# Altium project Avionics GLoBe - NEO9N.PrjPcb
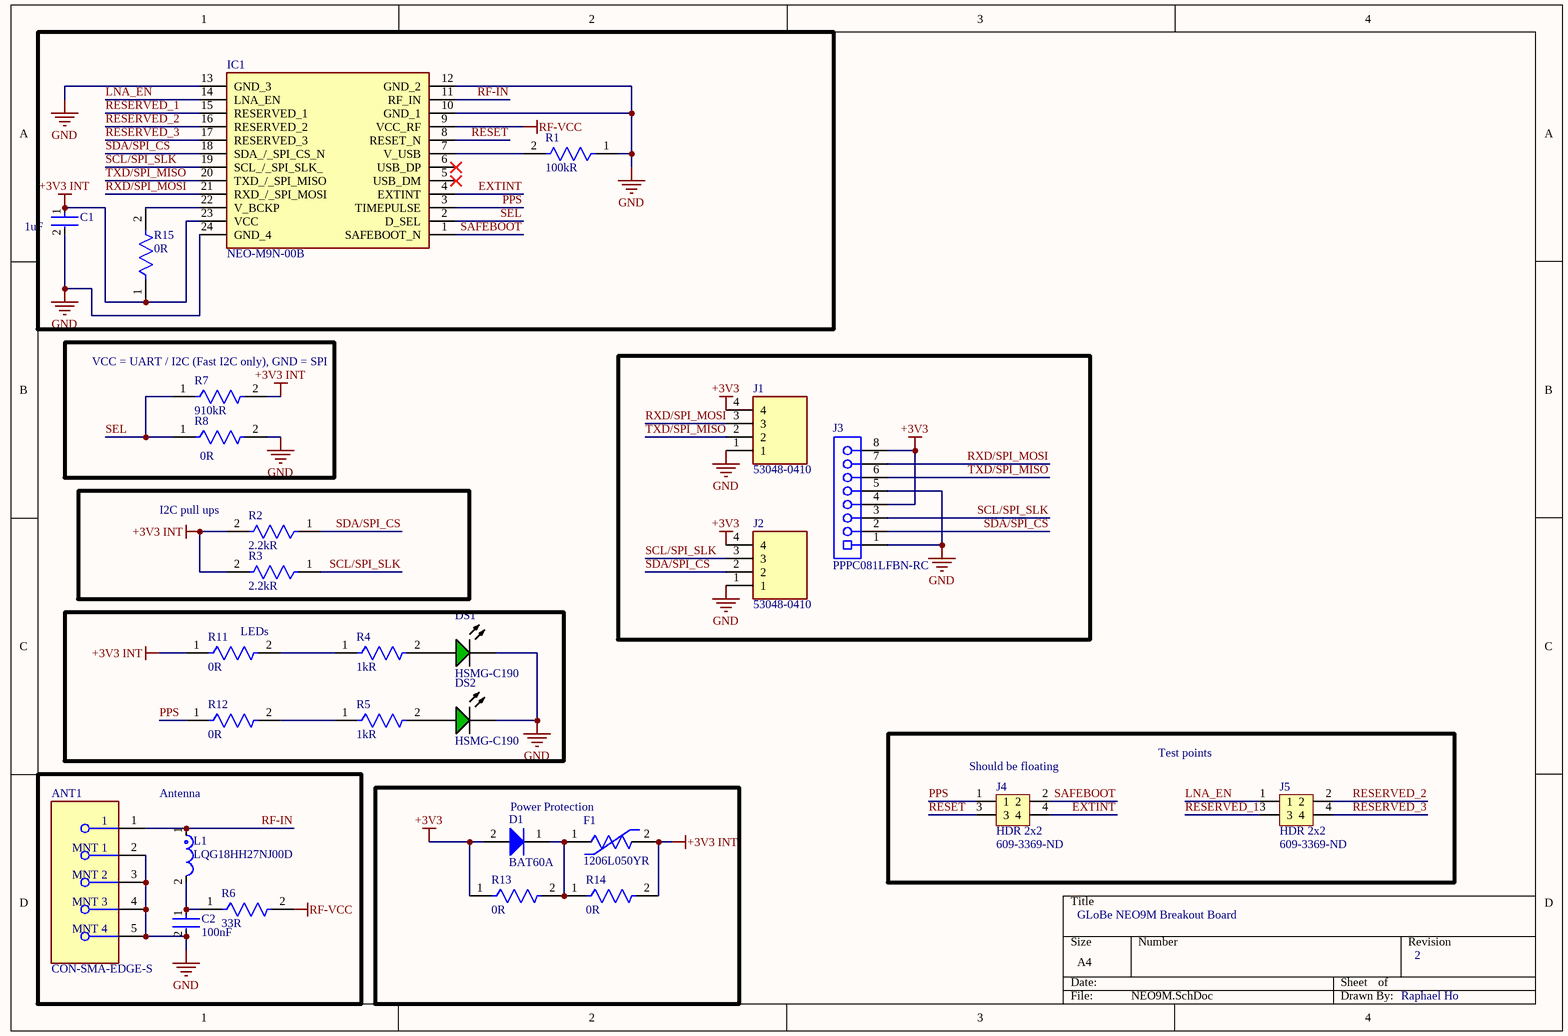
[diagram p0: NEO9M.SchDoc]
1 sheet, 27 parts. Net scope: global (net labels, ports and power ports of the same name join across sheets).
Board file: NEO9M.PcbDoc

## Sheet NEO9M.SchDoc
size A4; SheetNumber: 1; SheetTotal: 1

### Parts
ANT1  CON-SMA-EDGE-S  [FP-CON-SMA-EDGE-S-MFG]
C1  1uF  [FP-GCM188-0_1-IPC_B]
C2  100nF  [FP-GCM188-0_1-IPC_A]
D1  BAT60A  [INF-SOD323_V]
DS1  HSMG-C190  [AVAG-HSMX-C190_V]
DS2  HSMG-C190  [AVAG-HSMX-C190_V]
F1  1206L050YR  [FP-1206L050YR-MFG]
IC1  NEO-M9N-00B  [NEOM9N00B]
J1  53048-0410  [530480410]
J2  53048-0410  [530480410]
J3  PPPC081LFBN-RC  [SLIN-PPPC081LFBN-RC_V]
J4  HDR 2x2  Supplier Part Number 1: 609-3369-ND  [HDR_2x2_2.54mm]
J5  HDR 2x2  Supplier Part Number 1: 609-3369-ND  [HDR_2x2_2.54mm]
L1  LQG18HH27NJ00D  [FP-LQG18HH_00-IPC_C]
R1  100kR  [FP-AC0603-MFG]
R2  2.2kR  [FP-AC0603-IPC_B]
R3  2.2kR  [FP-AC0603-IPC_B]
R4  1kR  [FP-AC0603-IPC_A]
R5  1kR  [FP-AC0603-IPC_A]
R6  33R  [FP-AC0603-IPC_C]
R7  910kR  [FP-AC0603-IPC_B]
R8  0R  [FP-AC0603-IPC_A]
R11  0R  [FP-AC0603-IPC_A]
R12  0R  [FP-AC0603-IPC_A]
R13  0R  [FP-AC0603-IPC_A]
R14  0R  [FP-AC0603-IPC_A]
R15  0R  [FP-AC0603-IPC_A]

### Blocks framed on the sheet
VCC = UART / I2C (Fast I2C only), GND = SPI: R7 R8
I2C pull ups: R2 R3
LEDs: DS1 DS2 R4 R5 R11 R12
Antenna: ANT1 C2 L1 R6
Power Protection: D1 F1 R13 R14

### Nets
+3V3: D1.2(A) J1.4 J2.4 J3.4 J3.8 R13.1
+3V3 INT: C1.1 F1.2 IC1.23(VCC) R2.2 R3.2 R7.2 R11.1 R14.2 R15.1
GND: ANT1.2(MNT_1) ANT1.3(MNT_2) ANT1.4(MNT_3) ANT1.5(MNT_4) C1.2 C2.2 DS1.2(K) DS2.2(K) IC1.10(GND_1) IC1.12(GND_2) IC1.13(GND_3) IC1.24(GND_4) J1.1 J2.1 J3.1 J3.5 R1.1 R8.2
RF-VCC: IC1.9(VCC_RF) R6.2
EXTINT: IC1.4(EXTINT) J4.4
LNA_EN: IC1.14(LNA_EN) J5.1
PPS: IC1.3(TIMEPULSE) J4.1 R12.1
RESERVED_1: IC1.15(RESERVED_1) J5.3
RESERVED_2: IC1.16(RESERVED_2) J5.2
RESERVED_3: IC1.17(RESERVED_3) J5.4
RESET: IC1.8(RESET_N) J4.3
RF-IN: ANT1.1 IC1.11(RF_IN) L1.1
RXD/SPI_MOSI: IC1.21(RXD_/_SPI_MOSI) J1.3 J3.7
SAFEBOOT: IC1.1(SAFEBOOT_N) J4.2
SCL/SPI_SLK: IC1.19(SCL_/_SPI_SLK_) J2.3 J3.3 R3.1
SDA/SPI_CS: IC1.18(SDA_/_SPI_CS_N) J2.2 J3.2 R2.1
SEL: IC1.2(D_SEL) R7.1 R8.1
TXD/SPI_MISO: IC1.20(TXD_/_SPI_MISO) J1.2 J3.6
NetC2_1: C2.1 L1.2 R6.1
NetD1_1: D1.1(K) F1.1 R13.2 R14.1
NetDS1_1: DS1.1(A) R4.2
NetDS2_1: DS2.1(A) R5.2
NetIC1_7: IC1.7(V_USB) R1.2
NetIC1_22: IC1.22(V_BCKP) R15.2
NetR4_1: R4.1 R11.2
NetR5_1: R5.1 R12.2

Not connected (* = marked no-connect by the designer): IC1 5(USB_DM)* 6(USB_DP)*

### Notes on the sheet
- (near J4) Should be floating
- Test points
- GLoBe NEO9M Breakout Board
- 2
- Raphael Ho

### Library data of the parts
ANT1 = CMP-204357-000001-1: CONN SMA JACK STR EDGE MNT; Manufacturer: RF Solutions Ltd.; Impedance: 50Ω; Conn Orientation: Right Angle; Is Female: yes; Number Of Contacts: 1; Frequency: 18GHz; Shielding: true; Category: Conn; ComponentLink2URL: https://www.rfsolutions.co.uk/downloads/1498648656DS-CON-EDGE-SMA-4.pdf; Octopart: https://octopart.com/con-sma-edge-s-rf+solutions-70967450; Package: CONN_JACK; Manufacturer Part Number: CON-SMA-EDGE-S; Height: 6.35mm; Device Class L1: Connectors; Footprint Url: https://forum.upverter.com/uploads/default/original/3X/b/e/be75b907af57498775929d6d9099689c472e0307.pdf; Contact Material: Gold; ComponentLink2Description: Datasheet; Device Class L2: RF / Coaxial Connectors; RoHS: TRUE; Device Class L3: unset; Digikey Description: CONN SMA JACK STR EDGE MNT; Lead Free: Yes; Automotive: No
C1 = CMP-2006-02357-2: Ceramic Capacitor for Automotive 1uF  ±10% 16VDC X7R 0603 Paper T/R; Voltage: 16V; Thickness: 0.035inch; Width: 0.031inch; Radiation Hardening: No; Depth: 0.8mm; Max Operating Temperature: 125°C; Package Quantity: 1; Ratings: AEC-Q200; Min Operating Temperature: -55°C; Packaging: Tape and Reel; Case Code (Metric): 1608; REACH SVHC: No SVHC; Dielectric: X7R; Case Code (Imperial): 0603; Length: 1.6mm; Height: 0.8mm; Voltage Rating: 16V; Termination: SMD/SMT; Case/Package: 0603; Voltage Rating (DC): 16V; Tolerance: 10%; Capacitance: 1uF; Mount: Surface Mount; Lead Free: Lead Free
C2 = CMP-2006-02376-2: CAP CER 0.1UF 50V X7R 0603; Tolerance: 10%; Depth: 0.8mm; Thickness: 0.035inch; Case/Package: 0603; Max Operating Temperature: 125°C; Termination: SMD/SMT; Dielectric: X7R; Mount: Surface Mount; Ratings: AEC-Q200; Capacitance: 100nF; Packaging: Tape and Reel; Series: GCM; Package Quantity: 1; Voltage Rating (DC): 50V; Case Code (Imperial): 0603; Height: 0.8mm; Voltage Rating: 50V; Case Code (Metric): 1608; Min Operating Temperature: -55°C; Radiation Hardening: No; RoHS Compliant: Yes; Lead Free: Lead Free; Length: 1.6mm; Width: 0.031inch; Construction: Flat
D1 = CMP-1183-00008-2: Silicon Schottky Diode, -55 to 85 degC, SOD323, Reel, Green; Manufacturer: Infineon; Green: TRUE; VR (max): 10Â V; IF (max): 3,000Â mA; VF (max): 370Â mV; CT (max): 35Â pF; Configuration: Single; PackageDescription: 3-Pin Small Outline Transistor Package, 1.25 x 2 mm Body, 0.65 mm Pitch; PartNumber: BAT60A; Mounting Technology: Surface Mount; PackageReference: SOT323; ComponentLink1Description: Manufacturer URL; Packing: Reel; ComponentLink3URL: http://www.infineon.com/dgdl/SOT323-Package_Overview.pdf?folderId=db3a30431936bc4b0119533e1dcb3c92&fileId=db3a30431936bc4b011953495f283cb1; ComponentLink2URL: http://www.infineon.com/dgdl/bat60aseries.pdf?folderId=db3a304313d846880113def5812204a1&fileId=db3a304313d846880113def70c9304a9; ComponentLink1URL: http://www.infineon.com/; ComponentLink2Description: Datasheet; ComponentLink3Description: Package Specification
DS1 DS2 = CMP-1744-00002-1: Chip LED, Green, 2.2 V, -40 to 85 degC, 2-Pin SMD, RoHS, Tape and Reel; Frequency: 400 KHz; Max Supply Voltage: 5.5 V; Access Time: 3500 ns; Clock Frequency: 100 KHz; Case\Package: SOIC; Density: 32 kb; Nominal Supply Current: 2 mA; Interface: Serial; Min Supply Voltage: 1.7 V; Packaging: Tape and Reel; PackageReference: HSMX-C190; ComponentLink2URL: http://docs.avagotech.com/docs/AV02-0551EN; RoHSCompliant: true; Pins: 8; REACH SVHC: No SVHC; Max Operating Temperature: 85 degC; Width: 4 mm; Radiation Hardening: No; Package Quantity: 3000; ComponentLink3Description: Package Specification; ComponentLink1Description: Manufacturer URL; Min Operating Temperature: -40 degC; PackageDescription: 2-Pin Surface Mount Device, Body 1.6 x 0.8 mm, Height 0.9 mm; Max Clock Frequency: 100 KHz; Height: 1.5 mm; ComponentLink1URL: http://www.avagotech.com/; DatasheetVersion: Mar-12; ComponentLink2Description: Datasheet; Mount: Surface Mount; Length: 5 mm; ComponentLink3URL: http://www.fairchildsemi.com/dwg/MA/MA03D.pdf
F1 = CMP-08606-000073-1: PTC RESET FUSE 6V 500MA 1206; Trip Current: 1A; Current Rating: 100A; Resistance: 700mR; Approvals: cULus; Max Power Dissipation: 600mW; Time to Trip: 0.1s; Hold Current: 500mA; Min Operating Temperature: -40°C; Voltage Rating (DC): 6V; Working Voltage: 6V; Package Quantity: 4000; Termination: SMD/SMT; Lead Free: Lead Free; REACH SVHC: No SVHC; Series: 1206L; Max Voltage Rating (DC): 6V; Height: 0.75mm; Terminal Material: Copper; Packaging: Tape and Reel; Case Code (Imperial): 1206; Length: 3.4mm; RoHS Compliant: Yes; Operating Supply Voltage: 6V; Case Code (Metric): 3216; Width: 1.8mm; Max Current Rating: 100A; Case/Package: 1206; Power Dissipation: 600mW; Max Operating Temperature: 85°C; Voltage Rating: 6V
IC1 = NEO-M9N-00B: Integrated Circuit; Manufacturer_Name: U-Blox; Datasheet Link: https://content.u-blox.com/sites/default/files/NEO-M9N-00B_DataSheet_UBX-19014285.pdf; Height: 2.6mm; Manufacturer_Part_Number: NEO-M9N-00B; Mouser Part Number: 377-NEO-M9N-00B; Mouser Price/Stock: https://www.mouser.co.uk/ProductDetail/u-blox/NEO-M9N-00B?qs=DPoM0jnrROVeJ6BHpcwcjw%3D%3D
J1 J2 = 53048-0410: Connector; Manufacturer_Name: Molex; Datasheet Link: https://www.molex.com/pdm_docs/sd/530480410_sd.pdf; Height: 3.7mm; Manufacturer_Part_Number: 53048-0410; Mouser Part Number: 538-53048-0410; Mouser Price/Stock: https://www.mouser.co.uk/ProductDetail/Molex/53048-0410?qs=359VwiUTsp2msj5Tobchuw%3D%3D
J3 = CMP-002-00028-2: Female Header, Pitch 2.54 mm, 1 x 8 Position, Height 8.5 mm, Tail Length 3.2 mm, -40 to 105 degC, RoHS, Bulk; Manufacturer: Sullins; Package Reference: PPPC081LFBN-RC; Connector Type: Header; Datasheet Version: Jan-15; Package Description: Female Header, Pitch 2.54 mm, 1 x 8 Position, Height 8.5 mm, Tail Length 3.2 mm; RoHS Compliant: Unknown; Max Operating Temperature: 105°C; Case/Package: PPPC081LFBN-RC; Min Operating Temperature: -40°C; Datasheet URL: http://sullinscorp.com/catalogs/101_PAGE114-115_.100_FEMALE_HDR.pdf; Gender: Female; Mounting Technology: TH
J4 J5 = 68602-204HLF: CONN HEADER VERT 4POS 2.54MM; Manufacturer: Amphenol FCI; Gender: Male; Connector Type: Male Pin; Number of Positions: 4; Insulation Resistance: 5GR; Current Rating: 3A; Voltage Rating: 1.5kV; Row Spacing: 0.1inch; Contact Post Length: 3.81mm; Manufacturer Part Number: 68602-204HLF; RoHS: Yes; Category: Headers and Wire Housings; Stock 1: 3699; Pricing 1: 1=0,34000, 10=0,31900, 100=0,22320, 500=0,19132, 1000=0,15943, 5000=0,13665, 10000=0,12754 (USD); Mount: Through Hole; Housing Material: Thermoplastic; Contact Plating: Gold,GXT; Color: Black; Contact Material: Bronze; Min Operating Temperature: -65°C; Max Operating Temperature: 125°C; Termination: Solder; Packaging: Bulk; Number of Rows: 2; Number of Contacts: 4; Package Quantity: 100; Contact Gender: Male; Pitch: 2.54mm; Contact Mating Length: 0.23inch; Radiation Hardening: No; Flammability Rating: UL94 V-0; ComponentLink1URL: https://datasheet.ciiva.com/728/67996-728884.pdf?src-supplier=Digi-Key; ComponentLink1Description: https://datasheet.ciiva.com/728/67996-728884.pdf?src-supplier=Digi-Key; Supplier 1: Digi-Key
L1 = CMP-06042-012021-1: Multilayer type Inductor for Automotive 27nH ±5% 0.54Ω 500mA 0603; DC Resistance (DCR): 4.18mR; Packaging: Tape and Reel; Case/Package: 0603; Package Quantity: 4000; Inductance: 27nH; Termination: SMD/SMT
R1 = CMP-2000-04857-2: RES 100kΩ 5.00% 0.1W 0603; Tolerance: 5%; Voltage Rating: 50V; Power Rating: 100mW; Temperature Coefficient: 100ppm/°C; Case Code (Metric): 1608; Min Operating Temperature: -55°C; Number of Terminations: 2; Case Code (Imperial): 0603; Resistor Type: Thick Film; Construction: Rectangular; Features: Moisture Resistant; Case/Package: 0603; Packaging: Tape and Reel; Depth: 0.8mm; RoHS Compliant: Yes; Ratings: AEC-Q200; Lead Free: Lead Free; Max Operating Temperature: 155°C; Resistance: 100kR; Termination: SMD/SMT; Series: AC; Military Standard: Not; Max Power Dissipation: 100mW; Length: 1.6mm
R2 R3 = CMP-2000-04866-2: RES 2.2kΩ 5.00% 0.1W 0603; Power Rating: 100mW; Temperature Coefficient: 100ppm/°C; Tolerance: 5%; Voltage Rating: 50V; Max Operating Temperature: 155°C; RoHS Compliant: Yes; Features: Moisture Resistant; Contact Plating: Tin; Packaging: Tape and Reel; Resistor Type: Thick Film; Length: 1.6mm; Termination: SMD/SMT; Ratings: AEC-Q200; Case Code (Imperial): 0603; Number of Terminations: 2; Width: 0.8mm; Lead Free: Lead Free; Series: AC; Height: 0.45mm; Case Code (Metric): 1608; Min Operating Temperature: -55°C; Case/Package: 0603; Max Power Dissipation: 100mW; Resistance: 2.2kR; Radiation Hardening: No
R4 R5 = CMP-03412-041970-1: RES 1kΩ 1.00% 0.1W 0603; Tolerance: 1%; Case/Package: 0603; Resistance: 1kR; RoHS Compliant: Yes; Lead Free: Lead Free
R6 = CMP-03412-046720-1: RES 33Ω 0.50% 0.1W 0603; RoHS Compliant: Yes
R7 = CMP-03412-028406-2: RES 910KΩ 1.00% 0.1W 0603; Voltage Rating: 50V; Power Rating: 100mW; Tolerance: 1%; Temperature Coefficient: 100ppm/°C; Max Operating Temperature: 155°C; Resistor Type: Thick Film; Case Code (Metric): 1608; Number of Terminations: 2; Case/Package: 0603; Packaging: Tape and Reel; Length: 0.063inch; Width: 0.8mm; Case Code (Imperial): 0603; Series: AC; RoHS Compliant: Yes; Termination: SMD/SMT; Resistance: 910kR; Min Operating Temperature: -55°C; Max Power Dissipation: 100mW; Features: Moisture Resistant; Height: 0.022inch
R8 R11-R15 = CMP-03412-047235-1: RES 0Ω 0.00% 0.1W 0603; Tolerance: 5%; Resistance: 0mR; Case/Package: 0603; RoHS Compliant: Yes; Lead Free: Lead Free

## Assembly variants
Populated Components Only: not fitted R8 R13 R14